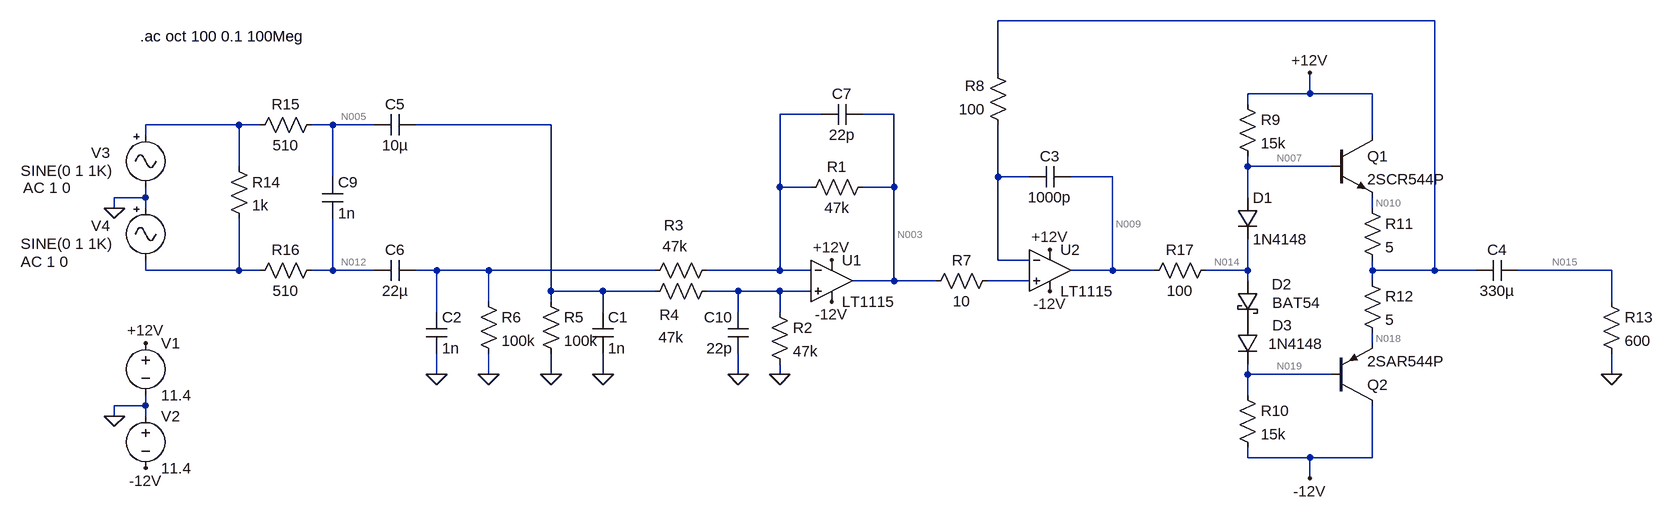
[diagram p0: schematic amp_sim.asc]
amp_sim.asc, the LTspice schematic file:
Version 4
SHEET 1 1448 680
WIRE 1072 -256 400 -256
WIRE 400 -176 400 -256
WIRE 880 -144 880 -176
WIRE 880 -144 784 -144
WIRE 976 -144 880 -144
WIRE 784 -128 784 -144
WIRE 128 -112 64 -112
WIRE 240 -112 192 -112
WIRE -768 -96 -912 -96
WIRE -736 -96 -768 -96
WIRE -624 -96 -656 -96
WIRE -560 -96 -624 -96
WIRE -288 -96 -496 -96
WIRE -912 -80 -912 -96
WIRE 976 -80 976 -144
WIRE -768 -32 -768 -96
WIRE 784 -32 784 -48
WIRE 912 -32 784 -32
WIRE -624 -16 -624 -96
WIRE 400 -16 400 -96
WIRE 448 -16 400 -16
WIRE 576 -16 512 -16
WIRE 64 0 64 -112
WIRE 112 0 64 0
WIRE 240 0 240 -112
WIRE 240 0 192 0
WIRE -912 16 -912 0
WIRE -912 16 -960 16
WIRE 784 16 784 -32
WIRE -960 32 -960 16
WIRE -912 32 -912 16
WIRE 976 32 976 16
WIRE 400 112 400 -16
WIRE 448 112 400 112
WIRE -912 128 -912 112
WIRE -768 128 -768 48
WIRE -768 128 -912 128
WIRE -736 128 -768 128
WIRE -624 128 -624 48
WIRE -624 128 -656 128
WIRE -560 128 -624 128
WIRE -464 128 -496 128
WIRE -384 128 -464 128
WIRE -128 128 -384 128
WIRE 64 128 64 0
WIRE 64 128 -48 128
WIRE 112 128 64 128
WIRE 576 128 576 -16
WIRE 576 128 512 128
WIRE 640 128 576 128
WIRE 784 128 784 80
WIRE 784 128 720 128
WIRE 976 128 976 112
WIRE 1072 128 1072 -256
WIRE 1072 128 976 128
WIRE 1136 128 1072 128
WIRE 1344 128 1200 128
WIRE 240 144 240 0
WIRE 240 144 176 144
WIRE 304 144 240 144
WIRE 448 144 384 144
WIRE 784 144 784 128
WIRE 976 144 976 128
WIRE -288 160 -288 -96
WIRE -208 160 -288 160
WIRE -128 160 -208 160
WIRE 0 160 -48 160
WIRE 64 160 0 160
WIRE 112 160 64 160
WIRE -384 176 -384 128
WIRE -288 176 -288 160
WIRE 1344 176 1344 128
WIRE -464 192 -464 128
WIRE -208 192 -208 160
WIRE 0 192 0 160
WIRE 64 192 64 160
WIRE 976 240 976 224
WIRE -464 288 -464 256
WIRE -384 288 -384 256
WIRE -288 288 -288 256
WIRE -208 288 -208 256
WIRE 0 288 0 256
WIRE 64 288 64 272
WIRE 784 288 784 272
WIRE 912 288 784 288
WIRE 1344 288 1344 256
WIRE 784 320 784 288
WIRE -912 336 -912 320
WIRE -912 336 -960 336
WIRE -960 352 -960 336
WIRE -912 352 -912 336
WIRE 784 416 784 400
WIRE 880 416 784 416
WIRE 976 416 976 336
WIRE 976 416 880 416
WIRE 880 448 880 416
FLAG 64 288 0
FLAG 144 112 +12V
FLAG -912 240 +12V
FLAG 144 176 -12V
FLAG -912 432 -12V
FLAG -960 352 0
FLAG 480 160 -12V
FLAG 480 96 +12V
FLAG 880 -176 +12V
FLAG 880 448 -12V
FLAG 1344 288 0
FLAG -960 32 0
FLAG -208 288 0
FLAG -288 288 0
FLAG -384 288 0
FLAG -464 288 0
FLAG 0 288 0
SYMBOL Opamps\\LT1115 144 80 R0
SYMATTR InstName U1
SYMBOL res 208 -16 R90
WINDOW 0 0 56 VBottom 2
WINDOW 3 32 56 VTop 2
SYMATTR InstName R1
SYMATTR Value 47k
SYMBOL res 48 176 R0
SYMATTR InstName R2
SYMATTR Value 47k
SYMBOL res -32 112 R90
WINDOW 0 -38 67 VBottom 2
WINDOW 3 -37 65 VTop 2
SYMATTR InstName R3
SYMATTR Value 47k
SYMBOL res -32 144 R90
WINDOW 0 68 74 VBottom 2
WINDOW 3 71 71 VTop 2
SYMATTR InstName R4
SYMATTR Value 47k
SYMBOL voltage -912 224 R0
WINDOW 123 0 0 Left 2
WINDOW 39 24 44 Left 2
SYMATTR InstName V1
SYMATTR Value 11.4
SYMBOL voltage -912 336 R0
WINDOW 123 0 0 Left 2
WINDOW 39 0 0 Left 2
SYMATTR InstName V2
SYMATTR Value 11.4
SYMBOL res 400 128 R90
WINDOW 0 0 56 VBottom 2
WINDOW 3 32 56 VTop 2
SYMATTR InstName R7
SYMATTR Value 10
SYMBOL Opamps\\LT1115 480 64 R0
SYMATTR InstName U2
SYMBOL cap 512 -32 R90
WINDOW 0 0 32 VBottom 2
WINDOW 3 32 32 VTop 2
SYMATTR InstName C3
SYMATTR Value 1000p
SYMBOL res 416 -80 R180
WINDOW 0 36 76 Left 2
WINDOW 3 36 40 Left 2
SYMATTR InstName R8
SYMATTR Value 100
SYMBOL diode 768 16 R0
SYMATTR InstName D1
SYMATTR Value 1N4148
SYMBOL diode 768 208 R0
WINDOW 0 54 4 Left 2
WINDOW 3 48 33 Left 2
SYMATTR InstName D3
SYMATTR Value 1N4148
SYMBOL res 768 -144 R0
SYMATTR InstName R9
SYMATTR Value 15k
SYMBOL res 768 304 R0
SYMATTR InstName R10
SYMATTR Value 15k
SYMBOL res 960 16 R0
SYMATTR InstName R11
SYMATTR Value 5
SYMBOL res 960 128 R0
SYMATTR InstName R12
SYMATTR Value 5
SYMBOL npn 912 -80 R0
SYMATTR InstName Q1
SYMATTR Value 2SCR544P
SYMBOL pnp 912 336 M180
SYMATTR InstName Q2
SYMATTR Value 2SAR544P
SYMBOL cap 1200 112 R90
WINDOW 0 0 32 VBottom 2
WINDOW 3 32 32 VTop 2
SYMATTR InstName C4
SYMATTR Value 330µ
SYMBOL res 1328 160 R0
SYMATTR InstName R13
SYMATTR Value 600
SYMBOL cap -496 -112 R90
WINDOW 0 0 32 VBottom 2
WINDOW 3 32 32 VTop 2
SYMATTR InstName C5
SYMATTR Value 10µ
SYMBOL cap -496 112 R90
WINDOW 0 0 32 VBottom 2
WINDOW 3 32 32 VTop 2
SYMATTR InstName C6
SYMATTR Value 22µ
SYMBOL Misc\\signal -912 -96 R0
WINDOW 0 -84 43 Left 2
WINDOW 3 -192 71 Left 2
WINDOW 123 -188 97 Left 2
WINDOW 39 0 0 Left 2
SYMATTR InstName V3
SYMATTR Value2 AC 1 0
SYMBOL Misc\\signal -912 16 R0
WINDOW 0 -84 43 Left 2
WINDOW 3 -192 71 Left 2
WINDOW 123 -192 99 Left 2
WINDOW 39 0 0 Left 2
SYMATTR InstName V4
SYMATTR Value2 AC 1 0
SYMBOL cap 192 -128 R90
WINDOW 0 0 32 VBottom 2
WINDOW 3 32 32 VTop 2
SYMATTR InstName C7
SYMATTR Value 22p
SYMBOL schottky 768 144 R0
WINDOW 0 53 5 Left 2
WINDOW 3 54 34 Left 2
SYMATTR InstName D2
SYMATTR Value BAT54
SYMBOL res -784 -48 R0
SYMATTR InstName R14
SYMATTR Value 1k
SYMBOL res -640 -112 R90
WINDOW 0 0 56 VBottom 2
WINDOW 3 32 56 VTop 2
SYMATTR InstName R15
SYMATTR Value 510
SYMBOL res -752 144 R270
WINDOW 0 32 56 VTop 2
WINDOW 3 0 56 VBottom 2
SYMATTR InstName R16
SYMATTR Value 510
SYMBOL cap -640 -16 R0
SYMATTR InstName C9
SYMATTR Value 1n
SYMBOL res 736 112 R90
WINDOW 0 0 56 VBottom 2
WINDOW 3 32 56 VTop 2
SYMATTR InstName R17
SYMATTR Value 100
SYMBOL res -304 160 R0
SYMATTR InstName R5
SYMATTR Value 100k
SYMBOL res -400 160 R0
SYMATTR InstName R6
SYMATTR Value 100k
SYMBOL cap -224 192 R0
SYMATTR InstName C1
SYMATTR Value 1n
SYMBOL cap -480 192 R0
SYMATTR InstName C2
SYMATTR Value 1n
SYMBOL cap 16 256 R180
WINDOW 0 24 56 Left 2
WINDOW 3 24 8 Left 2
SYMATTR InstName C10
SYMATTR Value 22p
TEXT -920 -232 Left 2 !.ac oct 100 0.1 100Meg

The netlist it stands for:
* amp_sim.asc
XU1 N017 N002 +12V -12V N003 LT1028  ; LT1115, pins In+ In- V+ V- OUT
R1 N003 N002 47k
R2 N017 0 47k
R3 N002 N013 47k
R4 N017 N006 47k
V1 +12V 0 11.4
V2 0 -12V 11.4
R7 N016 N003 10
XU2 N016 N008 +12V -12V N009 LT1028  ; LT1115, pins In+ In- V+ V- OUT
C3 N009 N008 1000p
R8 N008 N001 100
D1 N007 N014 1N4148
D3 P001 N019 1N4148
R9 +12V N007 15k
R10 N019 -12V 15k
R11 N010 N001 5
R12 N001 N018 5
Q1 +12V N007 N010 0 2SCR544P
Q2 -12V N019 N018 0 2SAR544P
C4 N015 N001 330µ
R13 N015 0 600
C5 N006 N005 10µ
C6 N013 N012 22µ
V3 N004 0 SINE(0 1 1K) AC 1 0
V4 0 N011 SINE(0 1 1K) AC 1 0
C7 N003 N002 22p
D2 N014 P001 BAT54
R14 N004 N011 1k
R15 N005 N004 510
R16 N011 N012 510
C9 N005 N012 1n
R17 N014 N009 100
R5 N006 0 100k
R6 N013 0 100k
C1 N006 0 1n
C2 N013 0 1n
C10 0 N017 22p
.model D D
.lib standard.dio
.model NPN NPN
.model PNP PNP
.lib standard.bjt
.ac oct 100 0.1 100Meg
.lib LTC.lib
.backanno
.end

* Results of the author's LTspice run, read from the files saved beside the schematic
* Operating Point, zero values left out:
*   V(+12v) = 11.4 V
*   V(-12v) = -11.4 V
*   V(n009) = 120 mV
*   V(n007) = 685.6 mV
*   V(n014) = 119.8 mV
*   V(p001) = -109.3 mV
*   V(n019) = -675.2 mV
*   V(n010) = 71.27 mV
*   V(n018) = -71.27 mV
*   Ic(Q2) = -14.2 mA
*   Ib(Q2) = -51.65 µA
*   Ie(Q2) = 14.25 mA
*   Ic(Q1) = 14.2 mA
*   Ib(Q1) = 53.06 µA
*   Ie(Q1) = -14.25 mA
*   I(D2) = 663.3 µA
*   I(D3) = 663.3 µA
*   I(D1) = 661.2 µA
*   I(R17) = -2.104 µA
*   I(R12) = 14.25 mA
*   I(R11) = 14.25 mA
*   I(R10) = 715 µA
*   I(R9) = 714.3 µA
*   I(V2) = -29.69 mA
*   I(V1) = -29.69 mA
*   Ix(u1:3) = 7.387 mA
*   Ix(u1:4) = -7.387 mA
*   Ix(u2:3) = 7.388 mA
*   Ix(u2:4) = -7.386 mA
*   Ix(u2:5) = -2.104 µA
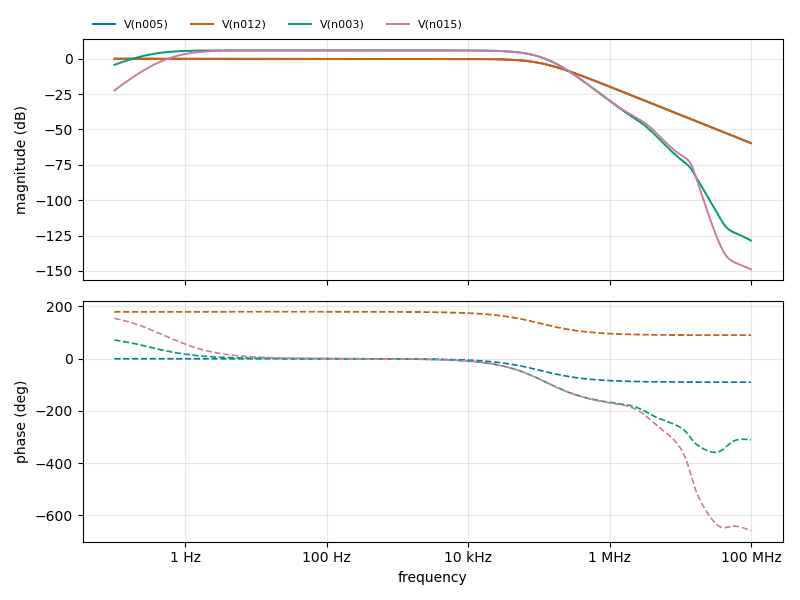
[diagram p1: AC Analysis of amp_sim.asc, plotted from the saved traces]
* AC Analysis, 1 run:
*   V(n005): -0.01 dB at 100 mHz, -59.66 dB at 100 MHz, peak -0.01 dB at 100 mHz, 3 dB below the peak at 103.3 kHz
*   V(n012): -0.02 dB at 100 mHz, -59.66 dB at 100 MHz, peak -0.02 dB at 100 mHz, 3 dB below the peak at 102 kHz
*   V(n003): -4.31 dB at 100 mHz, -128.52 dB at 100 MHz, peak 5.88 dB at 165.2 Hz, 3 dB below the peak at 312 mHz and 79.81 kHz
*   V(n015): -22.48 dB at 100 mHz, -148.97 dB at 100 MHz, peak 5.88 dB at 274 Hz, 3 dB below the peak at 907.1 mHz and 79.83 kHz